# EAGLE board posidmux (EAGLE 6.6.0), part 1 of 2
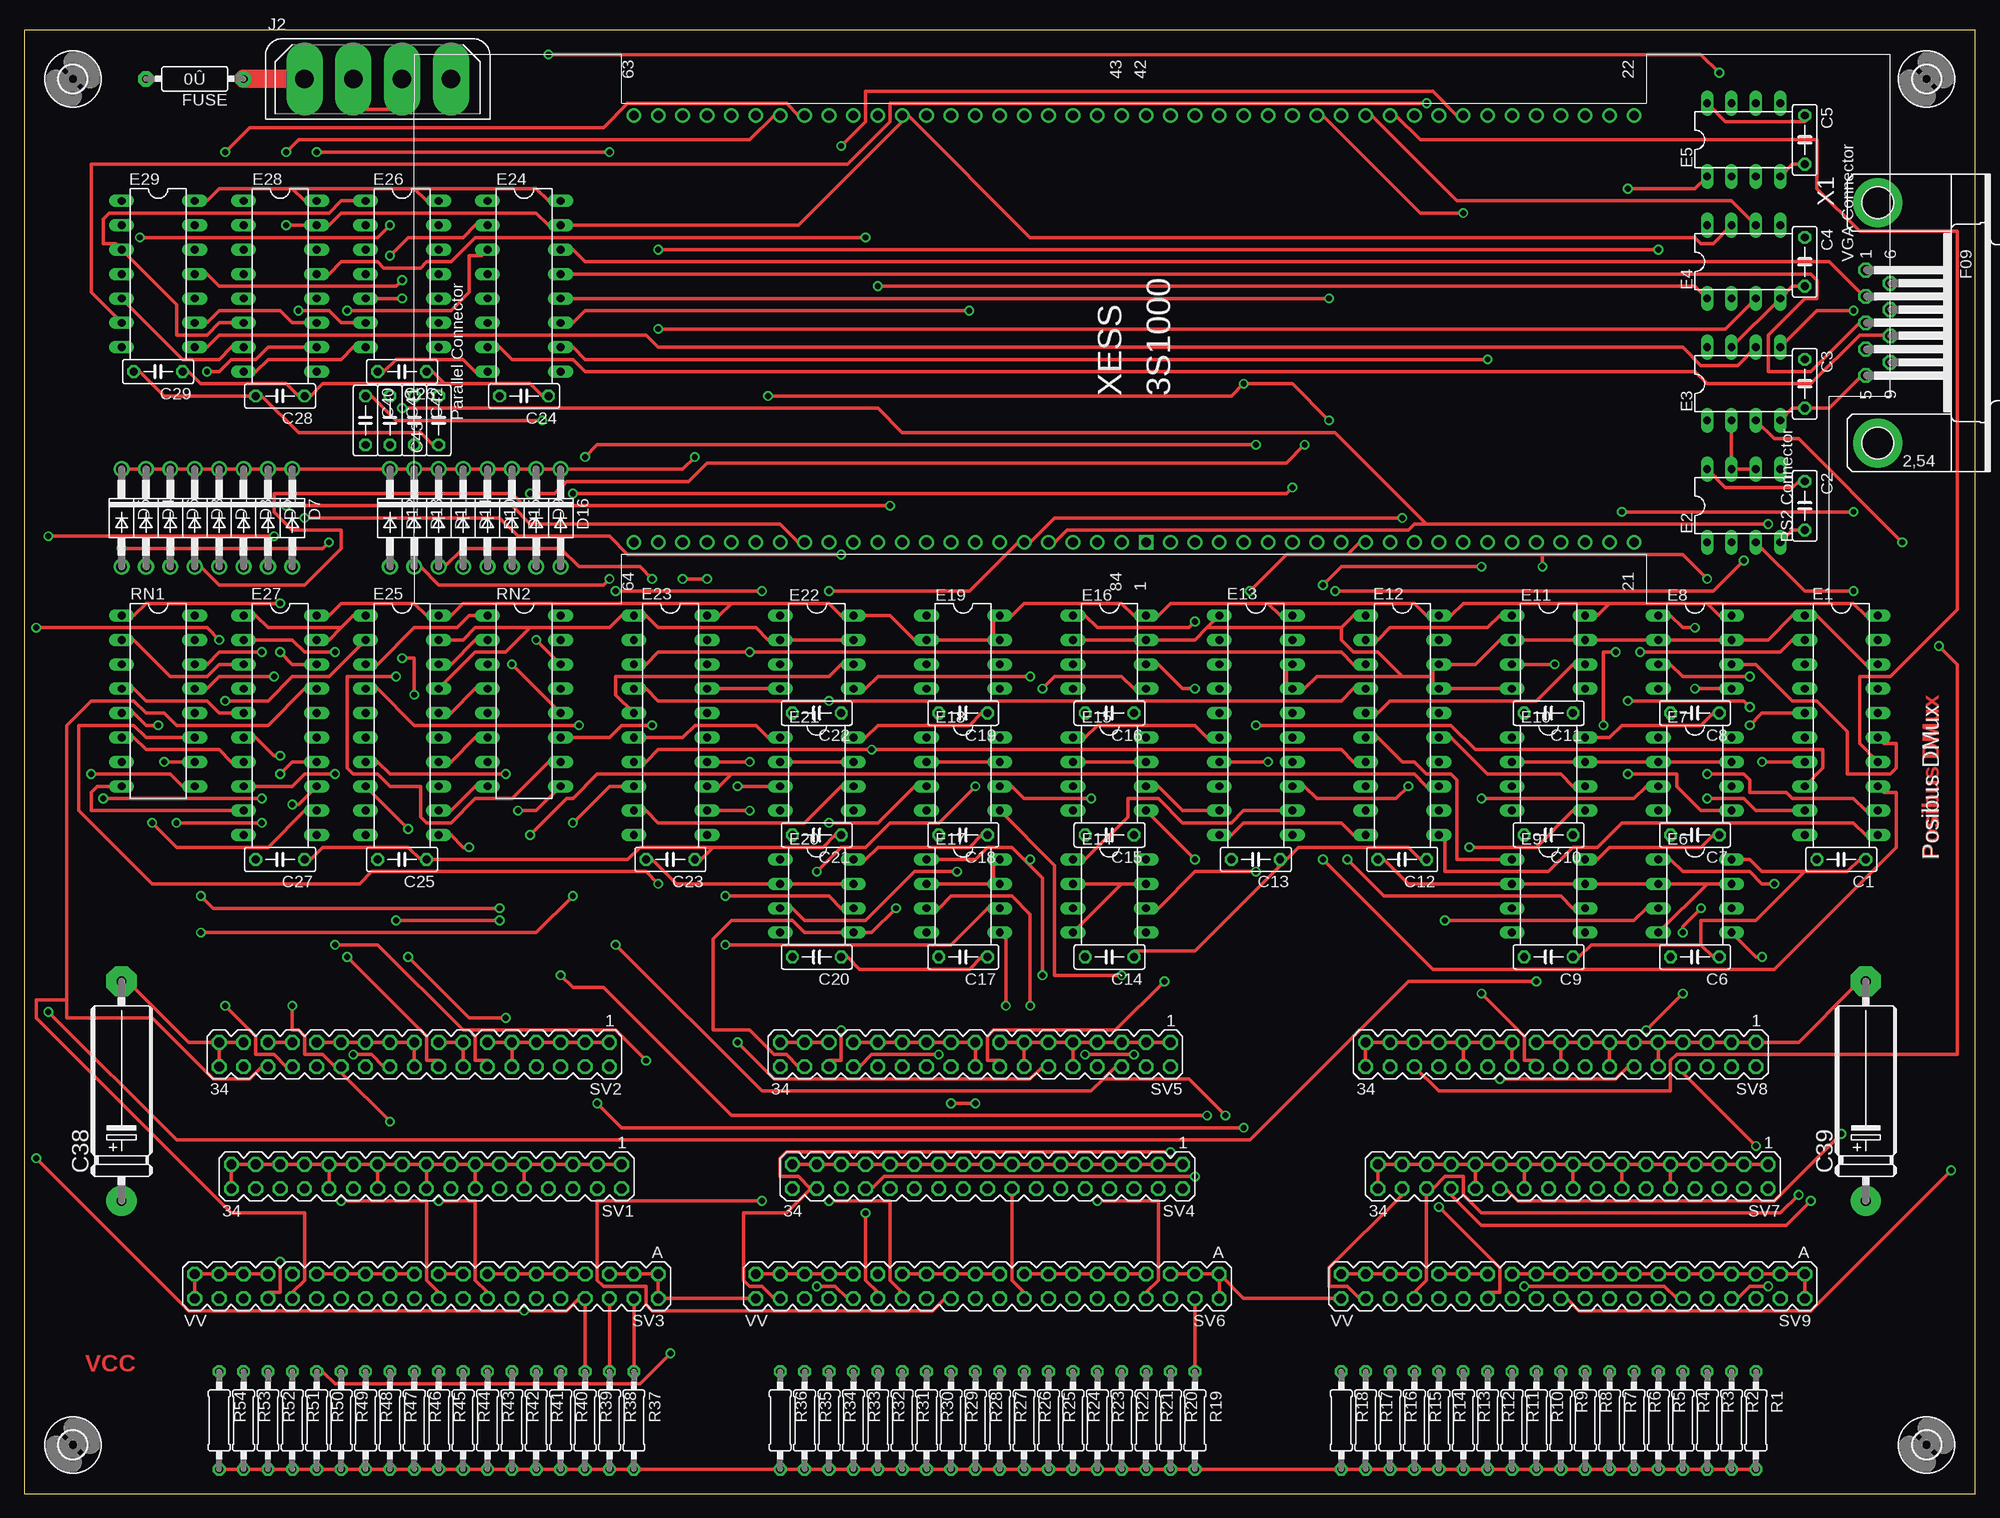
[diagram p3: board, top side]
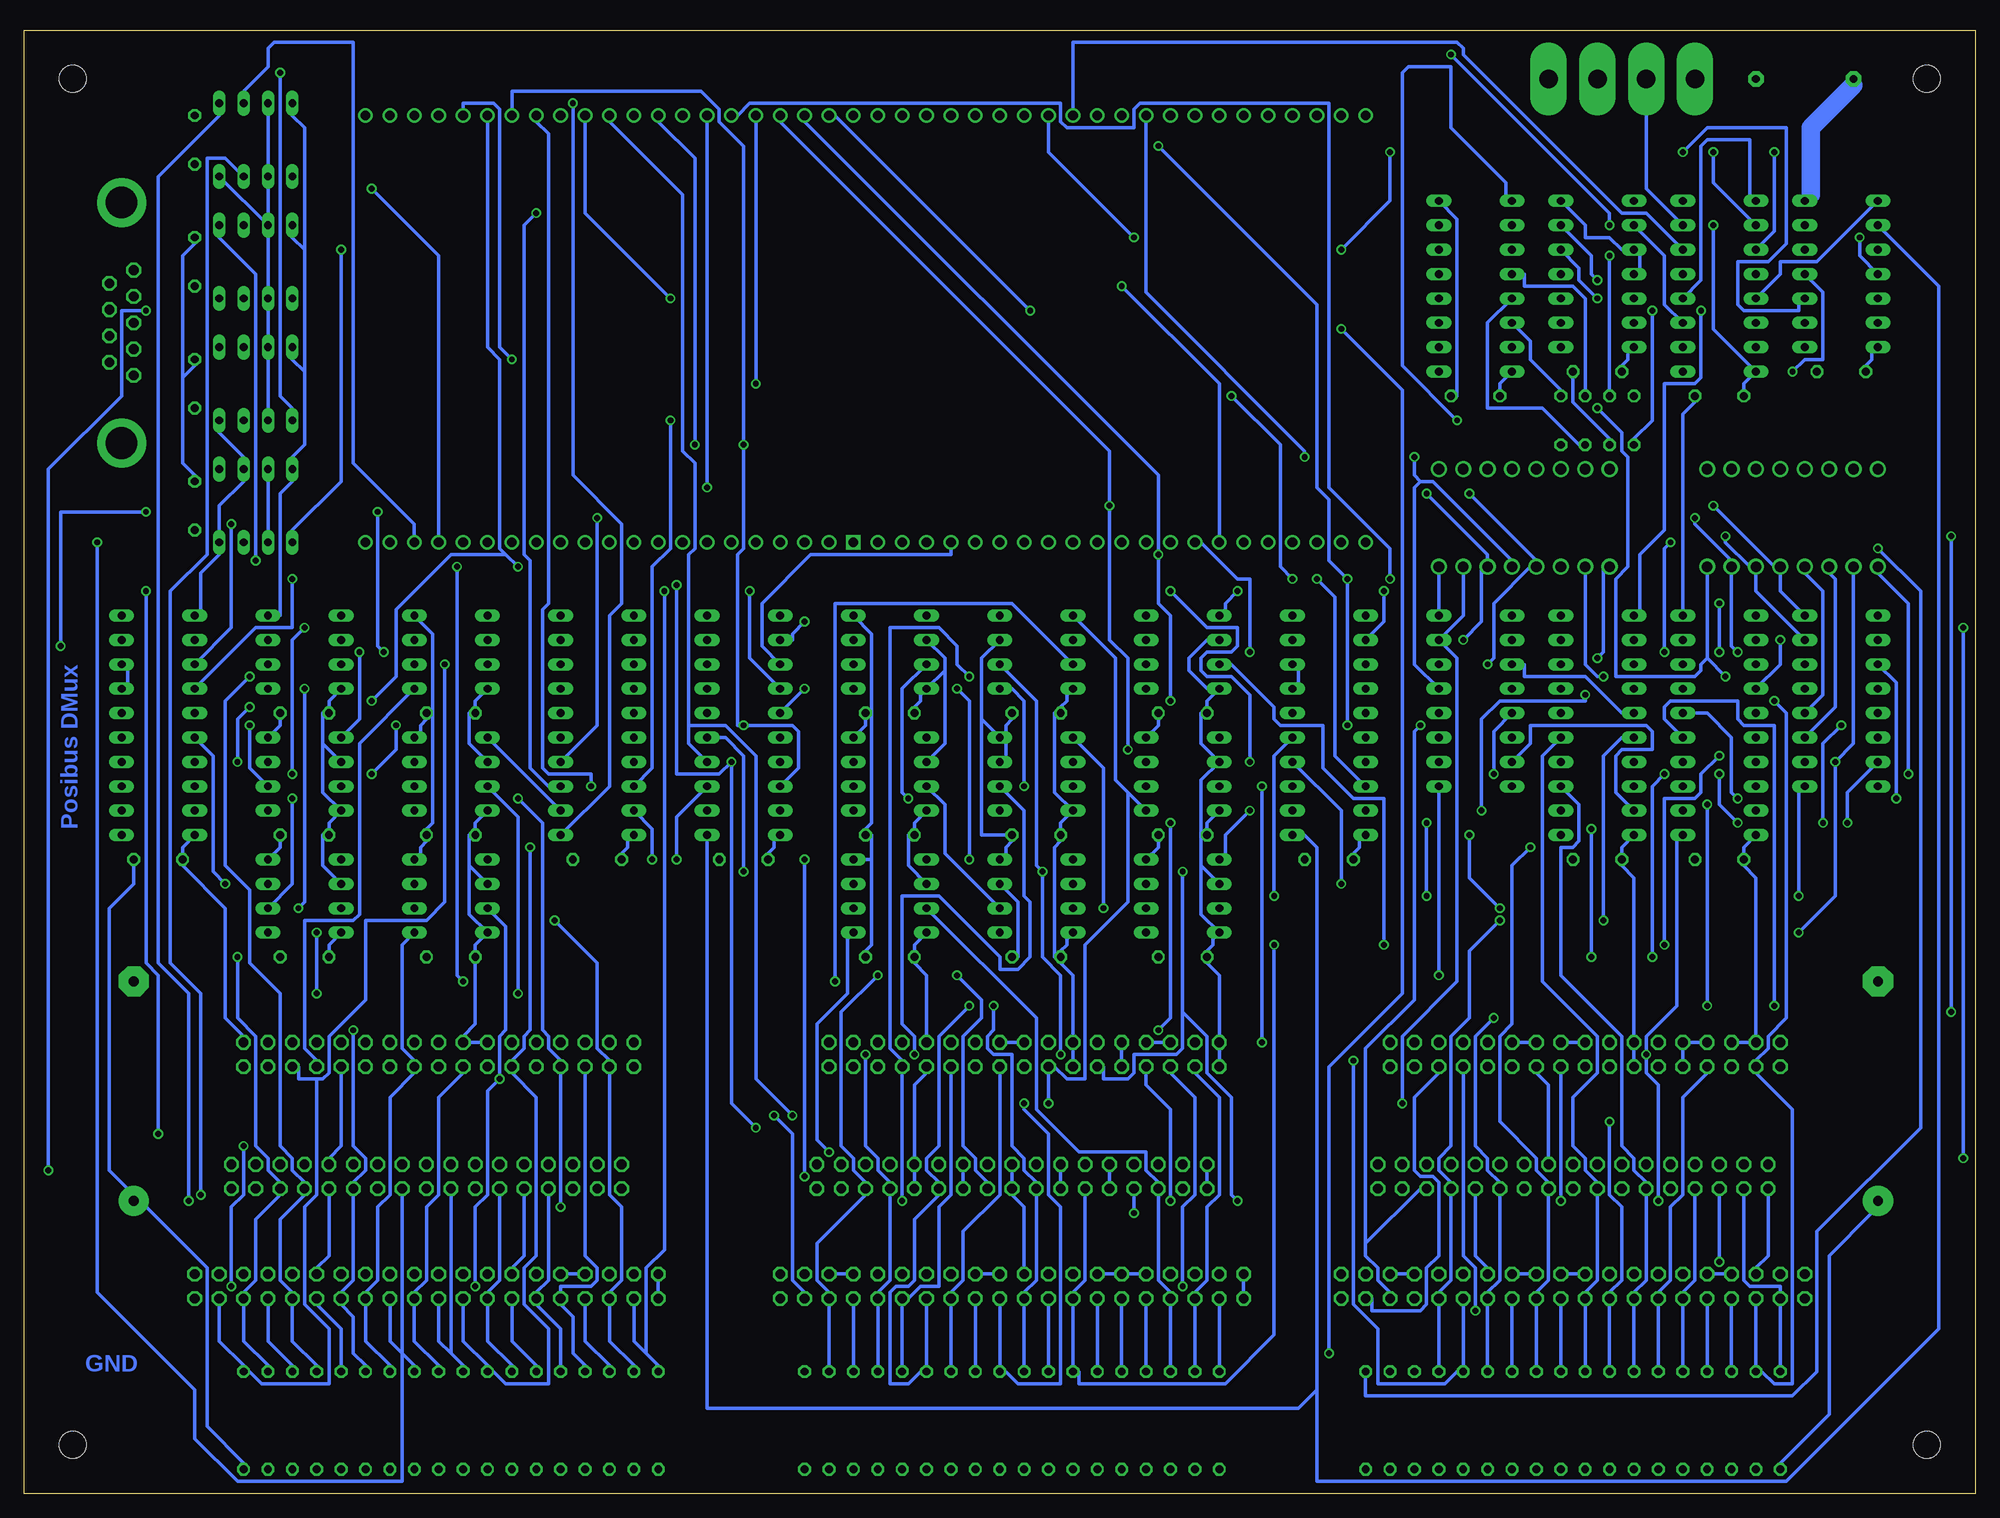
[diagram p4: board, bottom side, seen from below]

Size 203.2 x 152.4 mm. Coordinates in mm from the lower left corner, seen from the top.
Outline: 0,0 203.2,0 203.2,152.4 0,152.4 0,0
Copper layers (1*16): Top 0.035mm / dielectric 1.5mm / Bottom 0.035mm
Design rules "olimex10mil": minimum track width 15mil, minimum drill 24mil, track to track 15mil, track to pad 10mil, pad to pad 10mil, via to via 10mil, smd to smd 10mil, copper to edge 25mil, drill to drill 10mil, minimum pad ring 10mil, minimum via ring 8mil, stop-mask expansion 0mil, vias tented up to drill 0mil, thermal gap 10mil
Net classes: 1 Supply: width 1.905 mm, clearance 0.508 mm

## Footprints (pad centres in the part's own frame; a part is rotated, then mirrored left to right if it is on the bottom)
C050-025X075 = drill 0.813 octagon: 1 -2.54,0; 2 2.54,0
E22-6 = drill 1.016 pad 3.15: + -11.43,0 | drill 1.016 pad 3.15 octagon: - 11.43,0
DO41-10 = drill 1.118: A 5.08,0; C -5.08,0
DIL20 = drill 0.813 long: 1 -11.43,-3.81; 2 -8.89,-3.81; 3 -6.35,-3.81; 4 -3.81,-3.81; 5 -1.27,-3.81; 6 1.27,-3.81; 7 3.81,-3.81; 8 6.35,-3.81; 9 8.89,-3.81; 10 11.43,-3.81; 11 11.43,3.81; 12 8.89,3.81; 13 6.35,3.81; 14 3.81,3.81; 15 1.27,3.81; 16 -1.27,3.81; 17 -3.81,3.81; 18 -6.35,3.81; 19 -8.89,3.81; 20 -11.43,3.81
DIL08 = drill 0.813 long: 1 -3.81,-3.81; 2 -1.27,-3.81; 3 1.27,-3.81; 4 3.81,-3.81; 5 3.81,3.81; 6 1.27,3.81; 7 -1.27,3.81; 8 -3.81,3.81
DIL16 = drill 0.813 long: 1 -8.89,-3.81; 2 -6.35,-3.81; 3 -3.81,-3.81; 4 -1.27,-3.81; 5 1.27,-3.81; 6 3.81,-3.81; 7 6.35,-3.81; 8 8.89,-3.81; 9 8.89,3.81; 10 6.35,3.81; 11 3.81,3.81; 12 1.27,3.81; 13 -1.27,3.81; 14 -3.81,3.81; 15 -6.35,3.81; 16 -8.89,3.81
DIL14 = drill 0.813 long: 1 -7.62,-3.81; 2 -5.08,-3.81; 3 -2.54,-3.81; 4 0,-3.81; 5 2.54,-3.81; 6 5.08,-3.81; 7 7.62,-3.81; 8 7.62,3.81; 9 5.08,3.81; 10 2.54,3.81; 11 0,3.81; 12 -2.54,3.81; 13 -5.08,3.81; 14 -7.62,3.81
0R/10 = drill 0.813 pad 1.6 octagon: 1 -5.08,0; 2 5.08,0
FLOPPY-4 = drill 1.93 pad 3.81 long: 1 7.62,0; 2 2.54,0; 3 -2.54,0; 4 -7.62,0
0207/10 = drill 0.813 octagon: 1 -5.08,0; 2 5.08,0
MA17-2 = drill 1.016 octagon: 1 -20.32,-1.27; 2 -20.32,1.27; 3 -17.78,-1.27; 4 -17.78,1.27; 5 -15.24,-1.27; 6 -15.24,1.27; 7 -12.7,-1.27; 8 -12.7,1.27; 9 -10.16,-1.27; 10 -10.16,1.27; 11 -7.62,-1.27; 12 -7.62,1.27; 13 -5.08,-1.27; 14 -5.08,1.27; 15 -2.54,-1.27; 16 -2.54,1.27; 17 0,-1.27; 18 0,1.27; 19 2.54,-1.27; 20 2.54,1.27; 21 5.08,-1.27; 22 5.08,1.27; 23 7.62,-1.27; 24 7.62,1.27; 25 10.16,-1.27; 26 10.16,1.27; 27 12.7,-1.27; 28 12.7,1.27; 29 15.24,-1.27; 30 15.24,1.27; 31 17.78,-1.27; 32 17.78,1.27; 33 20.32,-1.27; 34 20.32,1.27
DEC40PINV = drill 1.016 octagon: A -24.13,-1.27; AA 3.81,-1.27; B -24.13,1.27; BB 3.81,1.27; C -21.59,-1.27; CC 6.35,-1.27; D -21.59,1.27; DD 6.35,1.27; E -19.05,-1.27; EE 8.89,-1.27; F -19.05,1.27; FF 8.89,1.27; H -16.51,-1.27; HH 11.43,-1.27; J -16.51,1.27; JJ 11.43,1.27; K -13.97,-1.27; KK 13.97,-1.27; L -13.97,1.27; LL 13.97,1.27; M -11.43,-1.27; MM 16.51,-1.27; N -11.43,1.27; NN 16.51,1.27; P -8.89,-1.27; PP 19.05,-1.27; R -8.89,1.27; RR 19.05,1.27; S -6.35,-1.27; SS 21.59,-1.27; T -6.35,1.27; TT 21.59,1.27; U -3.81,-1.27; UU 24.13,-1.27; V -3.81,1.27; VV 24.13,1.27; W -1.27,-1.27; X -1.27,1.27; Y 1.27,-1.27; Z 1.27,1.27
2,8 = hole 2.8: 0,0
F09HP = drill 1.016 octagon: 1 -5.486,-1.27; 2 -2.743,-1.27; 3 0,-1.27; 4 2.743,-1.27; 5 5.486,-1.27; 6 -4.115,1.27; 7 -1.372,1.27; 8 1.372,1.27; 9 4.115,1.27 | drill 3.302 pad 5.08: G1 -12.522,0; G2 12.522,0
3S1000 = drill 1.016 square: 1 0,0 | drill 1.016: 2 0,-2.54; 3 0,-5.08; 4 0,-7.62; 5 0,-10.16; 6 0,-12.7; 7 0,-15.24; 8 0,-17.78; 9 0,-20.32; 10 0,-22.86; 11 0,-25.4; 12 0,-27.94; 13 0,-30.48; 14 0,-33.02; 15 0,-35.56; 16 0,-38.1; 17 0,-40.64; 18 0,-43.18; 19 0,-45.72; 20 0,-48.26; 21 0,-50.8; 22 44.45,-50.8; 23 44.45,-48.26; 24 44.45,-45.72; 25 44.45,-43.18; 26 44.45,-40.64; 27 44.45,-38.1; 28 44.45,-35.56; 29 44.45,-33.02; 30 44.45,-30.48; 31 44.45,-27.94; 32 44.45,-25.4; 33 44.45,-22.86; 34 44.45,-20.32; 35 44.45,-17.78; 36 44.45,-15.24; 37 44.45,-12.7; 38 44.45,-10.16; 39 44.45,-7.62; 40 44.45,-5.08; 41 44.45,-2.54; 42 44.45,0; 43 44.45,2.54; 44 44.45,5.08; 45 44.45,7.62; 46 44.45,10.16; 47 44.45,12.7; 48 44.45,15.24; 49 44.45,17.78; 50 44.45,20.32; 51 44.45,22.86; 52 44.45,25.4; 53 44.45,27.94; 54 44.45,30.48; 55 44.45,33.02; 56 44.45,35.56; 57 44.45,38.1; 58 44.45,40.64; 59 44.45,43.18; 60 44.45,45.72; 61 44.45,48.26; 62 44.45,50.8; 63 44.45,53.34; 64 0,53.34; 65 0,50.8; 66 0,48.26; 67 0,45.72; 68 0,43.18; 69 0,40.64; 70 0,38.1; 71 0,35.56; 72 0,33.02; 73 0,30.48; 74 0,27.94; 75 0,25.4; 76 0,22.86; 77 0,20.32; 78 0,17.78; 79 0,15.24; 80 0,12.7; 81 0,10.16; 82 0,7.62; 83 0,5.08; 84 0,2.54

## Placement (x,y rotation side)
C1  [C050-025X075]  189.23,66.04 180 top
C2  [C050-025X075]  185.42,102.87 270 top
C3  [C050-025X075]  185.42,115.57 270 top
C4  [C050-025X075]  185.42,128.27 270 top
C5  [C050-025X075]  185.42,140.97 270 top
C6  [C050-025X075]  173.99,55.88 180 top
C7  [C050-025X075]  173.99,68.58 180 top
C8  [C050-025X075]  173.99,81.28 180 top
C9  [C050-025X075]  158.75,55.88 180 top
C10  [C050-025X075]  158.75,68.58 180 top
C11  [C050-025X075]  158.75,81.28 180 top
C12  [C050-025X075]  143.51,66.04 180 top
C13  [C050-025X075]  128.27,66.04 180 top
C14  [C050-025X075]  113.03,55.88 180 top
C15  [C050-025X075]  113.03,68.58 180 top
C16  [C050-025X075]  113.03,81.28 180 top
C17  [C050-025X075]  97.79,55.88 180 top
C18  [C050-025X075]  97.79,68.58 180 top
C19  [C050-025X075]  97.79,81.28 180 top
C20  [C050-025X075]  82.55,55.88 180 top
C21  [C050-025X075]  82.55,68.58 180 top
C22  [C050-025X075]  82.55,81.28 180 top
C23  [C050-025X075]  67.31,66.04 180 top
C24  [C050-025X075]  52.07,114.3 180 top
C25  [C050-025X075]  39.37,66.04 180 top
C26  [C050-025X075]  39.37,116.84 180 top
C27  [C050-025X075]  26.67,66.04 180 top
C28  [C050-025X075]  26.67,114.3 180 top
C29  [C050-025X075]  13.97,116.84 180 top
C38  [E22-6]  10.16,41.91 90 top
C39  [E22-6]  191.77,41.91 90 top
C40  [C050-025X075]  35.56,111.76 270 top
C41  [C050-025X075]  38.1,111.76 270 top
C42  [C050-025X075]  40.64,111.76 270 top
C43  [C050-025X075]  43.18,111.76 90 top
D1  1N4004  [DO41-10]  20.32,101.6 270 top
D2  1N4004  [DO41-10]  25.4,101.6 270 top
D3  1N4004  [DO41-10]  17.78,101.6 270 top
D4  1N4004  [DO41-10]  12.7,101.6 270 top
D5  1N4004  [DO41-10]  10.16,101.6 270 top
D6  1N4004  [DO41-10]  15.24,101.6 270 top
D7  1N4004  [DO41-10]  27.94,101.6 270 top
D8  1N4004  [DO41-10]  22.86,101.6 270 top
D9  1N4004  [DO41-10]  53.34,101.6 270 top
D10  1N4004  [DO41-10]  48.26,101.6 270 top
D11  1N4004  [DO41-10]  43.18,101.6 270 top
D12  1N4004  [DO41-10]  38.1,101.6 270 top
D13  1N4004  [DO41-10]  40.64,101.6 270 top
D14  1N4004  [DO41-10]  45.72,101.6 270 top
D15  1N4004  [DO41-10]  50.8,101.6 270 top
D16  1N4004  [DO41-10]  55.88,101.6 270 top
E1  74LS373N  [DIL20]  189.23,80.01 270 top
E2  DS75453N  [DIL08]  179.07,102.87 0 top
E3  DS75453N  [DIL08]  179.07,115.57 0 top
E4  DS75453N  [DIL08]  179.07,128.27 0 top
E5  DS75453N  [DIL08]  179.07,140.97 0 top
E6  DS75453N  [DIL08]  173.99,62.23 270 top
E7  DS75453N  [DIL08]  173.99,74.93 270 top
E8  DS75453N  [DIL08]  173.99,87.63 270 top
E9  DS75453N  [DIL08]  158.75,62.23 270 top
E10  DS75453N  [DIL08]  158.75,74.93 270 top
E11  DS75453N  [DIL08]  158.75,87.63 270 top
E12  74LS373N  [DIL20]  143.51,80.01 270 top
E13  74LS373N  [DIL20]  128.27,80.01 270 top
E14  DS75453N  [DIL08]  113.03,62.23 270 top
E15  DS75453N  [DIL08]  113.03,74.93 270 top
E16  DS75453N  [DIL08]  113.03,87.63 270 top
E17  DS75452N  [DIL08]  97.79,62.23 270 top
E18  DS75452N  [DIL08]  97.79,74.93 270 top
E19  DS75452N  [DIL08]  97.79,87.63 270 top
E20  DS75453N  [DIL08]  82.55,62.23 270 top
E21  DS75453N  [DIL08]  82.55,74.93 270 top
E22  DS75453N  [DIL08]  82.55,87.63 270 top
E23  74LS373N  [DIL20]  67.31,80.01 270 top
E24  MAX232  [DIL16]  52.07,125.73 270 top
E25  74LS244N  [DIL20]  39.37,80.01 270 top
E26  74LS10N  [DIL14]  39.37,127 270 top
E27  74LS244N  [DIL20]  26.67,80.01 270 top
E28  74LS139N  [DIL16]  26.67,125.73 270 top
E29  74LS04N  [DIL14]  13.97,127 270 top
FUSE  [0R/10]  17.78,147.32 180 top
J2  [FLOPPY-4]  36.83,147.32 0 top
R1  [0207/10]  180.34,7.62 270 top
R2  [0207/10]  177.8,7.62 270 top
R3  [0207/10]  175.26,7.62 270 top
R4  [0207/10]  172.72,7.62 270 top
R5  [0207/10]  170.18,7.62 270 top
R6  [0207/10]  167.64,7.62 270 top
R7  [0207/10]  165.1,7.62 270 top
R8  [0207/10]  162.56,7.62 270 top
R9  [0207/10]  160.02,7.62 270 top
R10  [0207/10]  157.48,7.62 270 top
R11  [0207/10]  154.94,7.62 270 top
R12  [0207/10]  152.4,7.62 270 top
R13  [0207/10]  149.86,7.62 270 top
R14  [0207/10]  147.32,7.62 270 top
R15  [0207/10]  144.78,7.62 270 top
R16  [0207/10]  142.24,7.62 270 top
R17  [0207/10]  139.7,7.62 270 top
R18  [0207/10]  137.16,7.62 270 top
R19  [0207/10]  121.92,7.62 270 top
R20  [0207/10]  119.38,7.62 270 top
R21  [0207/10]  116.84,7.62 270 top
R22  [0207/10]  114.3,7.62 270 top
R23  [0207/10]  111.76,7.62 270 top
R24  [0207/10]  109.22,7.62 270 top
R25  [0207/10]  106.68,7.62 270 top
R26  [0207/10]  104.14,7.62 270 top
R27  [0207/10]  101.6,7.62 270 top
R28  [0207/10]  99.06,7.62 270 top
R29  [0207/10]  96.52,7.62 270 top
R30  [0207/10]  93.98,7.62 270 top
R31  [0207/10]  91.44,7.62 270 top
R32  [0207/10]  88.9,7.62 270 top
R33  [0207/10]  86.36,7.62 270 top
R34  [0207/10]  83.82,7.62 270 top
R35  [0207/10]  81.28,7.62 270 top
R36  [0207/10]  78.74,7.62 270 top
R37  [0207/10]  63.5,7.62 270 top
R38  [0207/10]  60.96,7.62 270 top
R39  [0207/10]  58.42,7.62 270 top
R40  [0207/10]  55.88,7.62 270 top
R41  [0207/10]  53.34,7.62 270 top
R42  [0207/10]  50.8,7.62 270 top
R43  [0207/10]  48.26,7.62 270 top
R44  [0207/10]  45.72,7.62 270 top
R45  [0207/10]  43.18,7.62 270 top
R46  [0207/10]  40.64,7.62 270 top
R47  [0207/10]  38.1,7.62 270 top
R48  [0207/10]  35.56,7.62 270 top
R49  [0207/10]  33.02,7.62 270 top
R50  [0207/10]  30.48,7.62 270 top
R51  [0207/10]  27.94,7.62 270 top
R52  [0207/10]  25.4,7.62 270 top
R53  [0207/10]  22.86,7.62 270 top
R54  [0207/10]  20.32,7.62 270 top
RN1  330  [DIL16]  13.97,82.55 270 top
RN2  [DIL16]  52.07,82.55 270 top
SV1  [MA17-2]  41.91,33.02 180 top
SV2  [MA17-2]  40.64,45.72 180 top
SV3  [DEC40PINV]  41.91,21.59 180 top
SV4  [MA17-2]  100.33,33.02 180 top
SV5  [MA17-2]  99.06,45.72 180 top
SV6  [DEC40PINV]  100.33,21.59 180 top
SV7  [MA17-2]  161.29,33.02 180 top
SV8  [MA17-2]  160.02,45.72 180 top
SV9  [DEC40PINV]  161.29,21.59 180 top
U$1  [2,8]  198.12,5.08 0 top
U$2  [2,8]  5.08,147.32 0 top
U$3  [2,8]  198.12,147.32 0 top
U$4  [2,8]  5.08,5.08 0 top
X1  [F09HP]  193.04,121.92 270 top
XESS  3S1000  [3S1000]  116.84,99.06 90 top